# Altium schematic sheet FC_V3_0_SCH_2021-06-05_17-42-28.schdoc
size 346 x 228 mm
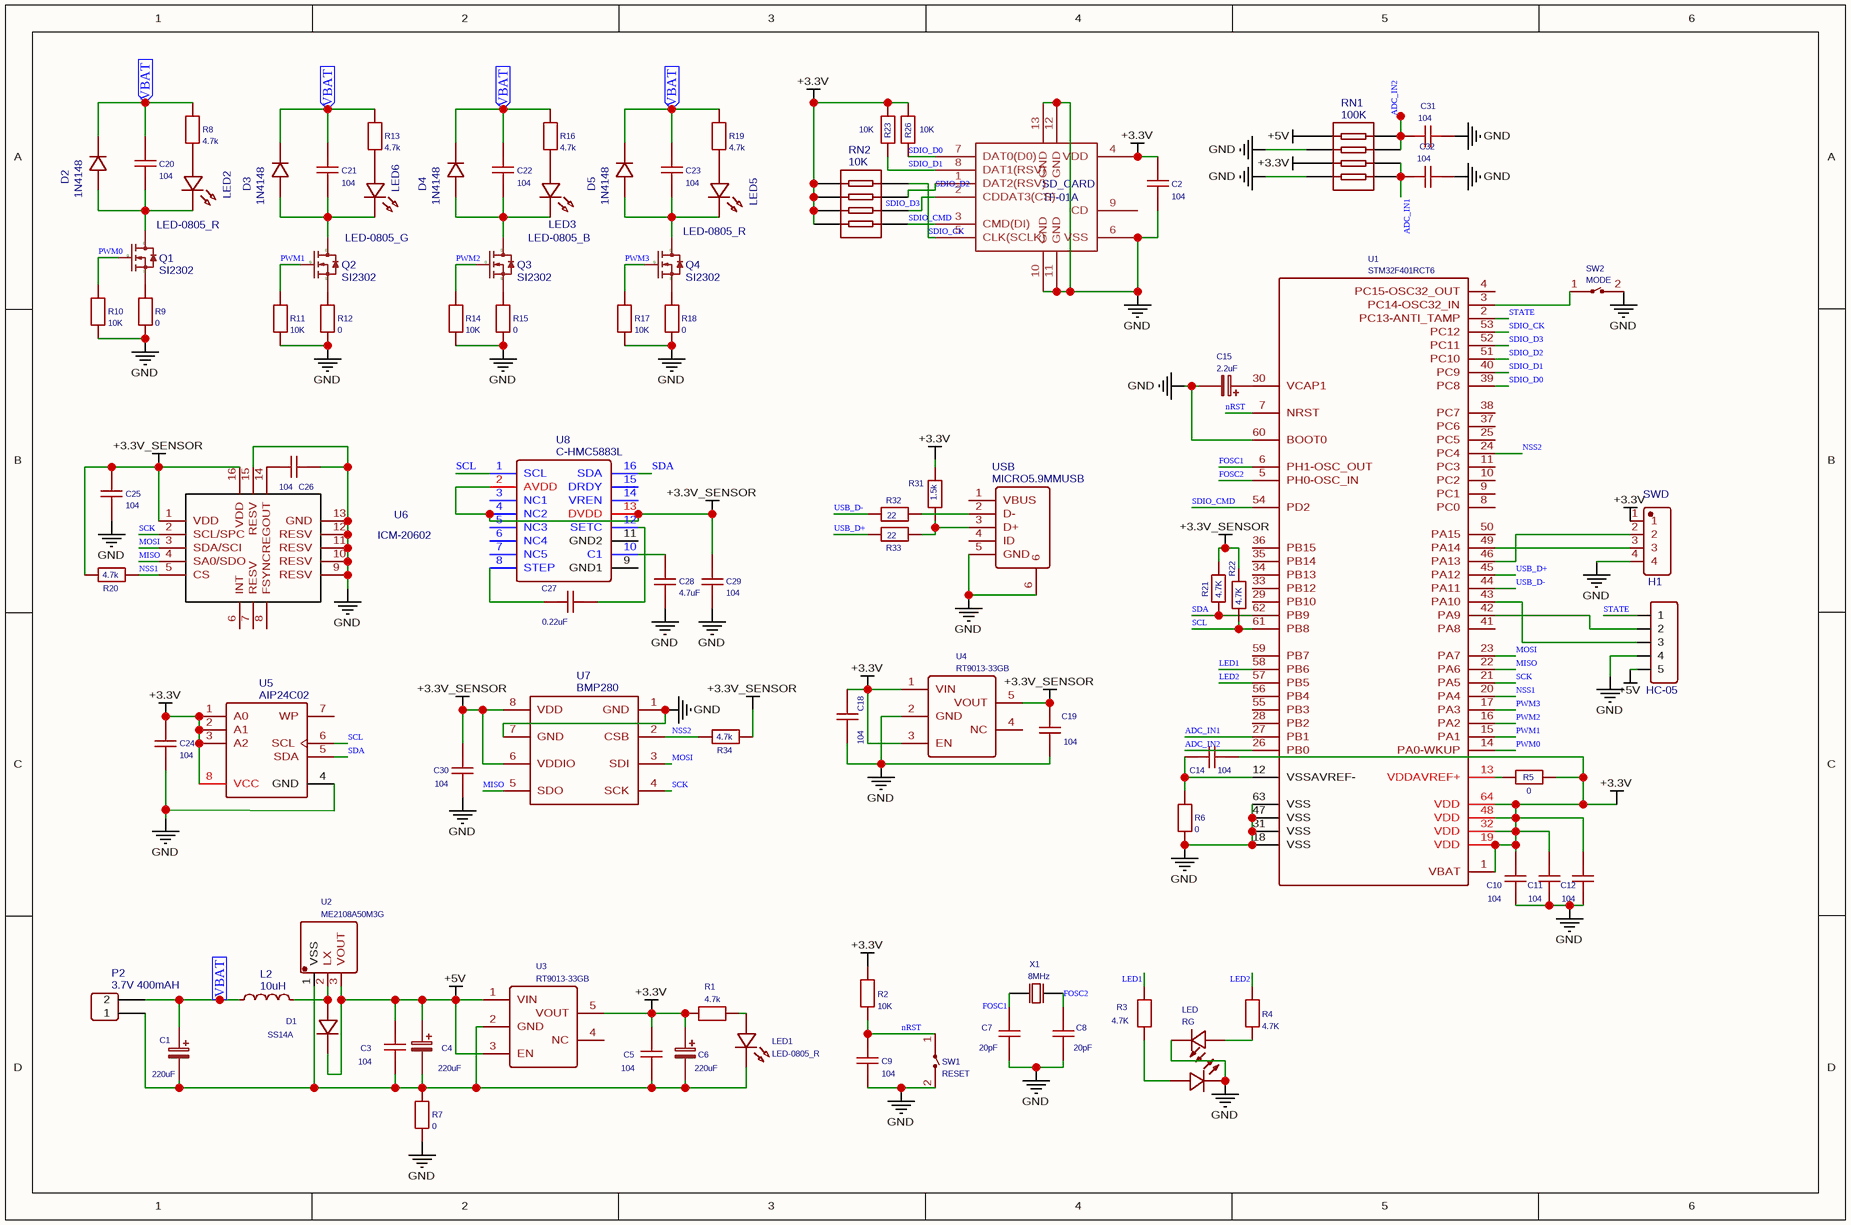
[diagram p0: FC_V3_0_SCH_2021-06-05_17-42-28.schdoc]

## Parts
C1  220uF  [CASE-A_3216]
C2  104  [C0603]
C3  104  [C0603]
C4  220uF  [CASE-A_3216]
C5  104  [C0603]
C6  220uF  [CASE-A_3216]
C7  20pF  [C0603]
C8  20pF  [C0603]
C9  104  [C0603]
C10  104  [C0603]
C11  104  [C0603]
C12  104  [C0603]
C14  104  [C0603]
C15  2.2uF  [CASE-A_3216]
C18  104  [C0603]
C19  104  [C0603]
C20  104  [C0603]
C21  104  [C0603]
C22  104  [C0603]
C23  104  [C0603]
C24  104  [C0603]
C25  104  [C0603]
C26  104  [C0603]
C27  0.22uF  [C0603]
C28  4.7uF  [C0603]
C29  104  [C0603]
C30  104  [C0603]
C31  104  [C0603]
C32  104  [C0603]
D1  SS14A  [SMA_L4.3-W2.6-LS5.2-RD]
D2  1N4148  [D1206-RD]
D3  1N4148  [D1206-RD]
D4  1N4148  [D1206-RD]
D5  1N4148  [D1206-RD]
H1  HC-05  [HDR-F-2.54_1X5]
L2  10uH  [IND-SMD_L4.4-W4.2]
LED  RG  [LED-ARRAY-SMD_3528-4P-L3.5-W2.8-TR]
LED1  LED-0805_R  [LED0805_RED]
LED2  LED-0805_R  [LED0805_RED]
LED3  LED-0805_B  [LED0805_BLUE]
LED5  LED-0805_R  [LED0805_RED]
LED6  LED-0805_G  [LED0805_GREEN]
P2  3.7V 400mAH  [HDR-TH_2P-P2.54-V-M]
Q1  SI2302  [SOT-23-3_L2.9-W1.3-P1.90-LS2.4-BR]
Q2  SI2302  [SOT-23-3_L2.9-W1.3-P1.90-LS2.4-BR]
Q3  SI2302  [SOT-23-3_L2.9-W1.3-P1.90-LS2.4-BR]
Q4  SI2302  [SOT-23-3_L2.9-W1.3-P1.90-LS2.4-BR]
R1  4.7k  [R0603]
R2  10K  [R0603]
R3  4.7K  [R0603]
R4  4.7K  [R0603]
R5  0  [R0603]
R6  0  [R0603]
R7  0  [R0805]
R8  4.7k  [R0603]
R9  0  [R0805]
R10  10K  [R0603]
R11  10K  [R0603]
R12  0  [R0805]
R13  4.7k  [R0603]
R14  10K  [R0603]
R15  0  [R0805]
R16  4.7k  [R0603]
R17  10K  [R0603]
R18  0  [R0805]
R19  4.7k  [R0603]
R20  4.7k  [R0603]
R21  4.7K  [R0603]
R22  4.7K  [R0603]
R23  10K  [R0603]
R26  10K  [R0603]
R31  1.5k  [R0603]
R32  22  [R0603]
R33  22  [R0603]
R34  4.7k  [R0603]
RN1  100K  [RES-ARRAY-SMD_0603-8P-L3.2-W1.6-BL]
RN2  10K  [RES-ARRAY-SMD_0603-8P-L3.2-W1.6-BL]
SD_CARD  TF-01A  [TF-SMD_TF-01A]
SW1  RESET  [SW-SMD_L6.0-W3.9-LS7.7]
SW2  MODE  [SW-SMD_L6.0-W3.9-LS7.7]
SWD  SWD  [HDR-M-2.54_1X4]  (value not drawn)
U1  STM32F401RCT6  [LQFP-64_L10.0-W10.0-P0.50-LS12.0-BL]
U2  ME2108A50M3G  [SOT-23-3_L2.9-W1.3-P1.90-LS2.4-BR]
U3  RT9013-33GB  [SOT-23-5_L3.0-W1.7-P0.95-LS2.8-BR]
U4  RT9013-33GB  [SOT-23-5_L3.0-W1.7-P0.95-LS2.8-BR]
U5  AIP24C02  [SOP-8_L5.0-W4.0-P1.27-LS6.2-BL]
U6  ICM-20602  [LGA-16_L3.0-W3.0-ICM20602]
U7  BMP280  [SENSOR-TH_BMP280-BL]
U8  C-HMC5883L  [C-LCC16]
USB  MICRO5.9MMUSB  [MICRO-USB-SMD_5P-P0.65-H-F_MICRO5.9MMUSB]
X1  8MHz  [SMD-5032_2P]

## Ports
VBAT (in)

## Nets
+3.3V: C2.2 C5.2 C6.1 C10.2 C11.2 C12.2 C14.2 C18.2 C24.2 R1.1 R2.2 R5.2 R23.1 R26.1 R31.2 RN1.7 RN2.5 RN2.6 RN2.7 RN2.8 SD_CARD.4(VDD) SWD.1 U1.1(VBAT) U1.19(VDD) U1.32(VDD) U1.48(VDD) U1.64(VDD) U3.5(VOUT) U4.1(VIN) U4.3(EN) U5.1(A0) U5.2(A1) U5.3(A2) U5.8(VCC)
+3.3V_SENSOR: C19.2 C25.1 C29.2 C30.2 R20.2 R21.1 R22.1 R34.1 U4.5(VOUT) U6.1(VDD) U6.16(VDD) U7.6(VDDIO) U7.8(VDD) U8.2(AVDD) U8.4(NC2) U8.13(DVDD)
+5V: C3.2 C4.1 D1.1(C) H1.5 RN1.5 U2.3(VOUT) U3.1(VIN) U3.3(EN)
GND: C2.1 C7.1 C8.1 C9.1 C10.1 C11.1 C12.1 C15.2 C18.1 C19.1 C24.1 C25.2 C26.2 C28.1 C29.1 C30.1 C31.1 C32.1 H1.4 LED.2(-) LED.4(-) R6.2 R7.2 R9.2 R10.1 R11.1 R12.2 R14.1 R15.2 R17.1 R18.2 RN1.6 RN1.8 SD_CARD.6(VSS) SD_CARD.10(GND) SD_CARD.11(GND) SD_CARD.12(GND) SD_CARD.13(GND) SW1.2 SW2.2 SWD.4 U1.18(VSS) U1.31(VSS) U1.47(VSS) U1.60(BOOT0) U1.63(VSS) U4.2(GND) U5.4(GND) U6.9(RESV) U6.10(RESV) U6.11(RESV) U6.12(RESV) U6.13(GND) U6.15(RESV) U7.1(GND) U7.7(GND) USB.5(GND) USB.6
ADC_IN1: C32.2 RN1.1 RN1.2 U1.27(PB1)
ADC_IN2: C31.2 RN1.3 RN1.4 U1.26(PB0)
FOSC1: C7.2 U1.6(PH1-OSC_OUT) X1.1(OSC1)
FOSC2: C8.2 U1.5(PH0-OSC_IN) X1.2(OSC2)
LED1: R3.2 U1.58(PB6)
LED2: R4.2 U1.57(PB5)
MISO: U1.22(PA6) U6.4(SA0/SDO) U7.5(SDO)
MOSI: U1.23(PA7) U6.3(SDA/SCI) U7.3(SDI)
nRST: C9.2 R2.1 SW1.1 U1.7(NRST)
NSS1: R20.1 U1.20(PA4) U6.5(CS)
NSS2: R34.2 U1.24(PC4) U7.2(CSB)
PWM0: Q1.1(G) R10.2 U1.14(PA0-WKUP)
PWM1: Q2.1(G) R11.2 U1.15(PA1)
PWM2: Q3.1(G) R14.2 U1.16(PA2)
PWM3: Q4.1(G) R17.2 U1.17(PA3)
SCK: U1.21(PA5) U6.2(SCL/SPC) U7.4(SCK)
SCL: R22.2 U1.61(PB8) U5.6(SCL) U8.1(SCL)
SDA: R21.2 U1.62(PB9) U5.5(SDA) U8.16(SDA)
SDIO_CK: RN2.4 SD_CARD.5(CLK(SCLK)) U1.53(PC12)
SDIO_CMD: RN2.1 SD_CARD.3(CMD(DI)) U1.54(PD2)
SDIO_D0: R26.2 SD_CARD.7(DAT0(D0)) U1.39(PC8)
SDIO_D1: R23.2 SD_CARD.8(DAT1(RSV)) U1.40(PC9)
SDIO_D2: RN2.3 SD_CARD.1(DAT2(RSV)) U1.51(PC10)
SDIO_D3: RN2.2 SD_CARD.2(CDDAT3(CS)) U1.52(PC11)
STATE: H1.1 U1.2(PC13-ANTI_TAMP)
USB_D+: R33.2 U1.45(PA12)
USB_D-: R32.2 U1.44(PA11)
VBAT: C1.1 C20.2 C21.2 C22.2 C23.2 D2.2 D3.2 D4.2 D5.2 L2.1 P2.2 R8.2 R13.2 R16.2 R19.2 ; port VBAT
NetC1_2: C1.2 C3.1 C4.2 C5.1 C6.2 LED1.2 P2.1 R7.1 U2.1(VSS) U3.2(GND)
NetC14_1: C14.1 R6.1 U1.12(VSSAVREF-)
NetC15_1: C15.1 U1.30(VCAP1)
NetC20_1: C20.1 D2.1 LED2.2 Q1.3(D)
NetC21_1: C21.1 D3.1 LED6.2 Q2.3(D)
NetC22_1: C22.1 D4.1 LED3.2 Q3.3(D)
NetC23_1: C23.1 D5.1 LED5.2 Q4.3(D)
NetC26_1: C26.1 U6.14(REGOUT)
NetC27_1: C27.1 U8.8(STEP)
NetC27_2: C27.2 U8.12(SETC)
NetC28_2: C28.2 U8.10(C1)
NetD1_2: D1.2(A) L2.2 U2.2(LX)
NetH1_2: H1.2 U1.42(PA9)
NetH1_3: H1.3 U1.43(PA10)
NetLED1_1: LED1.1 R1.2
NetLED2_1: LED2.1 R8.1
NetLED3_1: LED3.1 R16.1
NetLED5_1: LED5.1 R19.1
NetLED6_1: LED6.1 R13.1
NetLED_1: LED.1(+) R3.1
NetLED_3: LED.3(+) R4.1
NetQ1_2: Q1.2(S) R9.1
NetQ2_2: Q2.2(S) R12.1
NetQ3_2: Q3.2(S) R15.1
NetQ4_2: Q4.2(S) R18.1
NetR5_1: R5.1 U1.13(VDDAVREF+)
NetR31_1: R31.1 R33.1 USB.3(D+)
NetR32_1: R32.1 USB.2(D-)
NetSW2_1: SW2.1 U1.3(PC14-OSC32_IN)
NetSWD_2: SWD.2 U1.46(PA13)
NetSWD_3: SWD.3 U1.49(PA14)

Not connected (* = marked no-connect by the designer): SD_CARD 9(CD); U1 4(PC15-OSC32_OUT) 8(PC0) 9(PC1) 10(PC2) 11(PC3) 25(PC5) 28(PB2) 29(PB10) 33(PB12) 34(PB13) 35(PB14) 36(PB15) 37(PC6) 38(PC7) 41(PA8) 50(PA15) 55(PB3) 56(PB4) 59(PB7); U3 4(NC); U4 4(NC); U5 7(WP); U6 6(INT) 7(RESV) 8(FSYNC); U8 3(NC1) 5(NC3) 6(NC4) 7(NC5) 9(GND1) 11(GND2) 14(VREN) 15(DRDY); USB 1(VBUS) 4(ID)

## Library data of the parts
C1 C4 C6 = 220uF: nameAlias: Value(F); Contributor: LCEDA_Lib; spicePre: C; spiceSymbolName: C_Tan_SMD_A_EU
C2 C3 C5 C9-C12 C14 C18-C26 C29-C32 = 104: nameAlias: Value(F); Contributor: LCEDA_Lib; spicePre: C; spiceSymbolName: C_0805_US
C7 C8 = 20pF: nameAlias: Value(F); Contributor: LCEDA_Lib; spicePre: C; spiceSymbolName: C_0805_US
C15 = 2.2uF: nameAlias: Value(F); Contributor: LCEDA_Lib; spicePre: C; spiceSymbolName: C_Tan_SMD_A_EU
C27 = 0.22uF: nameAlias: Value(F); Contributor: LCEDA_Lib; spicePre: C; spiceSymbolName: C_0805_US
C28 = 4.7uF: nameAlias: Value(F); Contributor: LCEDA_Lib; spicePre: C; spiceSymbolName: C_0805_US
D1 = SS14A: BOM_Manufacturer: Yangzhou Yangjie Elec Tech; Contributor: LCSC; BOM_Supplier: LCSC; BOM_Supplier Part: C211770; BOM_Manufacturer Part: SS14A; spicePre: D; spiceSymbolName: SS14A
D2-D5 = 1N4148: BOM_Manufacturer: SEMTECH; Contributor: LCEDA_Lib; BOM_Supplier: LCSC; BOM_Manufacturer Part: 1N4148; BOM_Supplier Part: C14516; spicePre: D; spiceSymbolName: 1N4148
H1 = HC-05: Contributor: LCEDA_Lib; BOM_Supplier Part: C50950; BOM_Supplier: LCSC; spicePre: H; spiceSymbolName: HDR-F-2.54_1x5
L2 = 10uH: BOM_Manufacturer: Sunltech Tech; BOM_Manufacturer Part: SLO0420H1R5MTT; nameAlias: Inductance; Contributor: LCSC; BOM_Supplier: LCSC; BOM_Supplier Part: C207827; spicePre: L; spiceSymbolName: SLO0420H1R5MTT
LED = RG: BOM_Manufacturer: MEIHUA; BOM_Manufacturer Part: MHP3528URUGCT; Contributor: LCSC; BOM_Paste Type: expand; BOM_Supplier: LCSC; BOM_Supplier Part: C409778; spicePre: L; spiceSymbolName: MHP3528URUGCT
LED1 LED2 LED5 = LED-0805_R: BOM_Manufacturer: EVERLIGHT(台湾亿光); BOM_Manufacturer Part: 17-21SURC/S530-A3/TR8; Contributor: LCEDA_Lib; BOM_Supplier Part: C72037; spicePre: L; spiceSymbolName: LED-0805_R
LED3 = LED-0805_B: BOM_Manufacturer: 方舟 ARKLED; BOM_Manufacturer Part: D-B080508B1-KS2; Contributor: LCEDA_Lib; BOM_Supplier Part: C108412; spicePre: L; spiceSymbolName: LED-0805_B
LED6 = LED-0805_G: BOM_Manufacturer: 国星光电; BOM_Manufacturer Part: NCD0805G1; Contributor: LCEDA_Lib; BOM_Supplier Part: C84260; spicePre: L; spiceSymbolName: LED-0805_G
P2 = 3.7V 400mAH: BOM_Manufacturer: ReliaPro; BOM_Manufacturer Part: 2.54mm 1*2P; BOM_Supplier: LCSC; image: http://image.lceda.cn/szlcsc/C36717.jpg; BOM_Supplier Part: C36717; spicePre: P; spiceSymbolName: 2.54mm 1*2P
Q1-Q4 = SI2302: BOM_Manufacturer: Hottech; Contributor: LCSC; BOM_Paste Type: expand; BOM_Supplier: LCSC; BOM_Manufacturer Part: SI2302; BOM_Supplier Part: C181087; spicePre: Q; spiceSymbolName: SI2302
R1 R8 R13 R16 R19 R20 R34 = 4.7k: nameAlias: Value(Ω); Contributor: LCEDA_Lib; spicePre: R; spiceSymbolName: R_0805_EU
R2 R10 R11 R14 R17 R23 R26 = 10K: nameAlias: Value(Ω); Contributor: LCEDA_Lib; spicePre: R; spiceSymbolName: R_0805_EU
R3 R4 R21 R22 = 4.7K: nameAlias: Value(Ω); Contributor: LCEDA_Lib; spicePre: R; spiceSymbolName: R_0805_EU
R5-R7 R9 R12 R15 R18 = 0: nameAlias: Value(Ω); Contributor: LCEDA_Lib; spicePre: R; spiceSymbolName: R_0805_EU
R31 = 1.5k: nameAlias: Value(Ω); Contributor: LCEDA_Lib; spicePre: R; spiceSymbolName: R_0805_EU
R32 R33 = 22: nameAlias: Value(Ω); Contributor: LCEDA_Lib; spicePre: R; spiceSymbolName: R_0805_EU
RN1 = 100K: BOM_Manufacturer: FH; BOM_Manufacturer Part: RC-ML08W103JT; nameAlias: Resistance (Ohms); Contributor: LCSC; BOM_Supplier: LCSC; BOM_Supplier Part: C69593; spicePre: R; spiceSymbolName: RC-ML08W103JT
RN2 = 10K: BOM_Manufacturer: FH; BOM_Manufacturer Part: RC-ML08W103JT; nameAlias: Resistance (Ohms); Contributor: LCSC; BOM_Supplier: LCSC; BOM_Supplier Part: C69593; spicePre: R; spiceSymbolName: RC-ML08W103JT
SD_CARD = TF-01A: BOM_Manufacturer: HRO; BOM_Supplier: LCSC; BOM_Manufacturer Part: TF-01A; BOM_Supplier Part: C91145; spicePre: C; spiceSymbolName: TF-01A
SW1 = RESET: BOM_Manufacturer: 韩国韩荣; BOM_Manufacturer Part: K2-1107SR-A4SW-01; Contributor: LCSC; BOM_Supplier: LCSC; BOM_Supplier Part: C2690022; spicePre: S; spiceSymbolName: K2-1107SR-A4SW-01
SW2 = MODE: BOM_Manufacturer: 韩国韩荣; BOM_Manufacturer Part: K2-1107SR-A4SW-01; Contributor: LCSC; BOM_Supplier: LCSC; BOM_Supplier Part: C2690022; spicePre: S; spiceSymbolName: K2-1107SR-A4SW-01
SWD = SWD: BOM_Manufacturer: BOOMELE(博穆精密); BOM_Manufacturer Part: 2.54-1*4P母; Contributor: LCSC; BOM_Supplier: LCSC; BOM_Supplier Part: C2718488; spicePre: H; spiceSymbolName: 2.54-1*4P母
U1 = STM32F401RCT6: BOM_Manufacturer: STMicroelectronics; BOM_Paste Type: recommend; BOM_Supplier: LCSC; BOM_Manufacturer Part: STM32F401RCT6; BOM_Supplier Part: C74524; spicePre: U; spiceSymbolName: STM32F401RCT6
U2 = ME2108A50M3G: BOM_Manufacturer: MICRONE; BOM_Paste Type: expand; BOM_Supplier: LCSC; BOM_Manufacturer Part: ME2108A50M3G; BOM_Supplier Part: C14839; spicePre: U; spiceSymbolName: ME2108A50M3G
U3 U4 = RT9013-33GB: BOM_Manufacturer: RICHTEK; BOM_Paste Type: recommend; BOM_Supplier: LCSC; BOM_Manufacturer Part: RT9013-33GB; image: //image.lceda.cn/szlcsc/C47773.jpg; BOM_Supplier Part: C47773; spicePre: U; spiceSymbolName: RT9013-33GB
U5 = AIP24C02: BOM_Manufacturer: ZHONGWEI; BOM_Paste Type: expand; BOM_Supplier: LCSC; BOM_Manufacturer Part: AIP24C02; BOM_Supplier Part: C85316; spicePre: U; spiceSymbolName: AIP24C02
U6 = ICM-20602: BOM_Manufacturer Part: ICM20602; Contributor: bee2363; BOM_Supplier Part: 410-ICM-20602; BOM_Supplier: Mouser; spicePre: U; spiceSymbolName: ICM-20602
U7 = BMP280: BOM_Manufacturer: Bosch; BOM_Paste Type: expand; BOM_Supplier: LCSC; BOM_Manufacturer Part: BMP280; BOM_Supplier Part: C83291; spicePre: U; spiceSymbolName: BMP280
U8 = C-HMC5883L: BOM_Manufacturer: Honeywell; Contributor: PQG2030PQG; BOM_Supplier: LCSC; BOM_Manufacturer Part: HMC5883L; BOM_Supplier Part: C15640; spicePre: U; spiceSymbolName: C-HMC5883L
USB = MICRO5.9MMUSB: BOM_Manufacturer: SHOU HAN; Contributor: LCSC; BOM_Supplier: LCSC; BOM_Supplier Part: C393940; BOM_Manufacturer Part: MICRO5.9mmusb; spicePre: U; spiceSymbolName: MICRO5.9MMUSB
X1 = 8MHz: BOM_Manufacturer: Abracon LLC; BOM_Manufacturer Part: ABM2-29.4912MHZ-D4Y-T; nameAlias: Frequency; Contributor: LCSC; BOM_Supplier: LCSC; BOM_Supplier Part: C313041; spicePre: X; spiceSymbolName: ABM2-29.4912MHZ-D4Y-T